# Altium project 8051_setup.PrjPcb
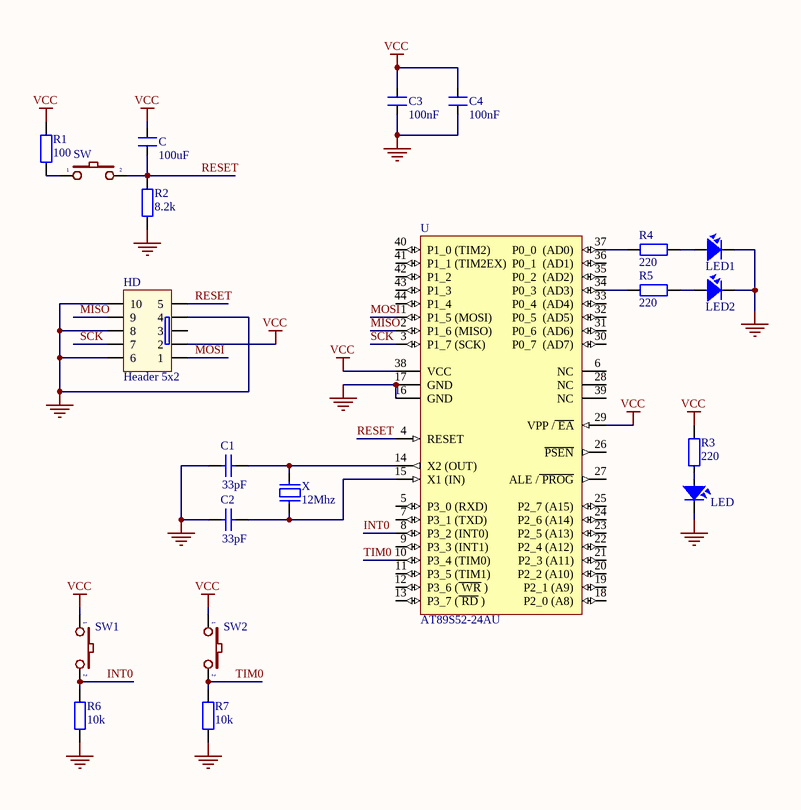
[diagram p0: Schematic.SchDoc]
1 sheet, 21 parts. Net scope: global (net labels, ports and power ports of the same name join across sheets).
Board file: PCB.PcbDoc

## Sheet Schematic.SchDoc
size A

### Parts
C  100uF  [SM-Cap-1206]
C1  33pF  [C0805]
C2  33pF  [C0805]
C3  100nF  [SM-Cap-1206]
C4  100nF  [SM-Cap-1206]
HD  Header 5x2  [Hed2X5]
LED  LED  [LED-0805-Red]  (value not drawn)
LED1  LED1  [LED-0805-Red]  (value not drawn)
LED2  LED  [LED-0805-Red]  (value not drawn)
R1  100  [SM-RES-0805]
R2  8.2k  [SM-RES-0805]
R3  220  [SM-RES-0805]
R4  220  [SM-RES-0805]
R5  220  [SM-RES-0805]
R6  10k  [SM-RES-0805]
R7  10k  [SM-RES-0805]
SW  (no value)  [SW1-SMD]
SW1  (no value)  [SW1-SMD]
SW2  (no value)  [SW1-SMD]
U  AT89S52-24AU  [TQFP44]
X  12Mhz  [XTAL-RU49/4]

### Nets
GND: C1.1 C2.1 C3.1 C4.1 HD.4 HD.6 HD.8 HD.10 LED.2 LED1.2 LED2.2 R2.1 R6.1 R7.1 U.16(GND) U.17(GND)
VCC: C.1 C3.2 C4.2 HD.2 R1.2 R3.2 SW1.1 SW2.1 U.29(VPP_/~{_EA}) U.38(VCC)
INT0: R6.2 SW1.2 U.8(P3_2_(INT0))
MISO: HD.9 U.2(P1_6_(MISO))
MOSI: HD.1 U.1(P1_5_(MOSI))
RESET: C.2 HD.5 R2.2 SW.2 U.4(RESET)
SCK: HD.7 U.3(P1_7_(SCK))
TIM0: R7.2 SW2.2 U.10(P3_4_(TIM0))
NetC1_2: C1.2 U.14(X2_(OUT)) X.2
NetC2_2: C2.2 U.15(X1_(IN)) X.1
NetLED1_1: LED1.1 R4.2
NetLED2_1: LED2.1 R5.2
NetLED_1: LED.1 R3.1
NetR1_1: R1.1 SW.1
NetR4_1: R4.1 U.37(P0_0__(AD0))
NetR5_1: R5.1 U.34(P0_3__(AD3))

Not connected (* = marked no-connect by the designer): HD 3; U 5(P3_0_(RXD)) 6(NC) 7(P3_1_(TXD)) 9(P3_3_(INT1)) 11(P3_5_(TIM1)) 12(P3_6_(~{_WR}_)) 13(P3_7_(~{_RD}_)) 18(P2_0_(A8)) 19(P2_1_(A9)) 20(P2_2_(A10)) 21(P2_3_(A11)) 22(P2_4_(A12)) 23(P2_5_(A13)) 24(P2_6_(A14)) 25(P2_7_(A15)) 26(~{PSEN}) 27(ALE_/~{_PROG}) 28(NC) 30(P0_7__(AD7)) 31(P0_6__(AD6)) 32(P0_5__(AD5)) 33(P0_4__(AD4)) 35(P0_2__(AD2)) 36(P0_1__(AD1)) 39(NC) 40(P1_0_(TIM2)) 41(P1_1_(TIM2EX)) 42(P1_2) 43(P1_3) 44(P1_4)

### Library data of the parts
C C3 C4 = CN: Value: 0,1uF/300V; Designed by: VanDungEvn
C1 C2 = CapSMD: Capacitor; Value: 33p; Published: 8-Jun-2000; LatestRevisionDate: 17-Jul-2002; LatestRevisionNote: Re-released for DXP Platform.; PackageReference: RAD-0.3; Publisher: Altium Limited
HD = HED5x2: Value: Header 5x2
LED LED1 LED2 = LED SMD: Value: LED 3 - 5 ly 2 Colour
R1-R7 = R1/4W: Resistor 1/4W; Value: R1/4W - 1K
SW SW1 SW2 = SW2: Switch button 2 pin; Value: SW chip 2 pin
U = AT89S52-24AU: Atmel 8 Bit Micro 4.0-5.5V 24MHz -40 to +80 Deg C 44TQFP (44A) Package GREEN OPTION; GREEN OPTION: YES; Vendor: ATMEL; PartNr: AT89S52-24AU; Package: 44A 44-lead, Thin Plastic Gull Wing Quad Flatpack (TQFP)
X = XT2: Crystal, 32.768 KHz, -40 to 85 degC, 3.2 x 1.5 x 0.9 mm SMD; Value: 4Mhz